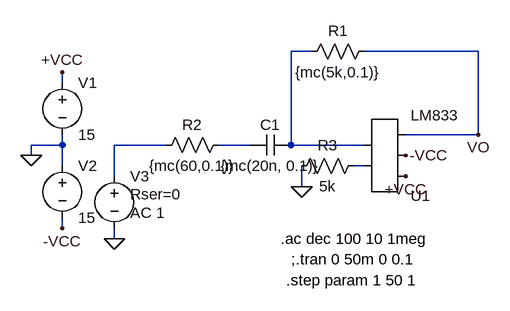
[diagram p0: schematic Derivador compensado con montecarlo.asc]
Derivador compensado con montecarlo.asc, the LTspice schematic file:
Version 4
SHEET 1 880 680
WIRE 256 -64 224 -64
WIRE 512 -64 336 -64
WIRE -128 -16 -128 -32
WIRE 512 64 512 -64
WIRE 512 64 400 64
WIRE -128 80 -128 64
WIRE -128 80 -176 80
WIRE 32 80 -48 80
WIRE 160 80 112 80
WIRE 224 80 224 -64
WIRE 336 80 224 80
WIRE -176 96 -176 80
WIRE -128 112 -128 80
WIRE 336 112 320 112
WIRE -48 128 -48 80
WIRE 240 144 240 112
WIRE -128 208 -128 192
WIRE -48 224 -48 208
FLAG -176 96 0
FLAG -128 -32 +VCC
FLAG -128 208 -VCC
FLAG 240 144 0
FLAG -48 224 0
FLAG 512 64 VO
FLAG 400 128 +VCC
FLAG 400 96 -VCC
SYMBOL voltage -128 -32 R0
WINDOW 123 0 0 Left 0
WINDOW 39 0 0 Left 0
SYMATTR InstName V1
SYMATTR Value 15
SYMBOL voltage -128 96 R0
WINDOW 123 0 0 Left 0
WINDOW 39 0 0 Left 0
SYMATTR InstName V2
SYMATTR Value 15
SYMBOL cap 224 64 R90
WINDOW 0 0 32 VBottom 2
WINDOW 3 32 32 VTop 2
SYMATTR InstName C1
SYMATTR Value {mc(20n, 0.1)}
SYMBOL res 352 -80 R90
WINDOW 0 0 56 VBottom 2
WINDOW 3 32 56 VTop 2
SYMATTR InstName R1
SYMATTR Value {mc(5k,0.1)}
SYMBOL AutoGenerated\\LM833 368 96 M180
SYMATTR InstName U1
SYMBOL voltage -48 112 R0
WINDOW 3 24 44 Left 2
WINDOW 123 24 72 Left 2
WINDOW 39 24 44 Left 2
SYMATTR Value ""
SYMATTR Value2 AC 1
SYMATTR SpiceLine Rser=0
SYMATTR InstName V3
SYMBOL res 128 64 R90
WINDOW 0 0 56 VBottom 2
WINDOW 3 32 56 VTop 2
SYMATTR InstName R2
SYMATTR Value {mc(60,0.1)}
SYMBOL res 336 96 R90
WINDOW 0 0 56 VBottom 2
WINDOW 3 32 56 VTop 2
SYMATTR InstName R3
SYMATTR Value 5k
TEXT 208 224 Left 2 !.ac dec 100 10 1meg
TEXT 224 256 Left 2 !;.tran 0 50m 0 0.1
TEXT 216 288 Left 2 !.step param 1 50 1

The netlist it stands for:
* Derivador compensado con montecarlo.asc
V1 +VCC 0 15
V2 0 -VCC 15
C1 N001 N003 {mc(20n, 0.1)}
R1 VO N001 {mc(5k,0.1)}
* U1: LM833 (symbol AutoGenerated\LM833 not available, pins judged from their places): pin1=N004 pin2=N001 pin3=+VCC pin4=-VCC pin5=VO
V3 N002 0 AC 1 Rser=0
R2 N003 N002 {mc(60,0.1)}
R3 N004 0 5k
.ac dec 100 10 1meg
;.tran 0 50m 0 0.1
.step param 1 50 1
.backanno
.end